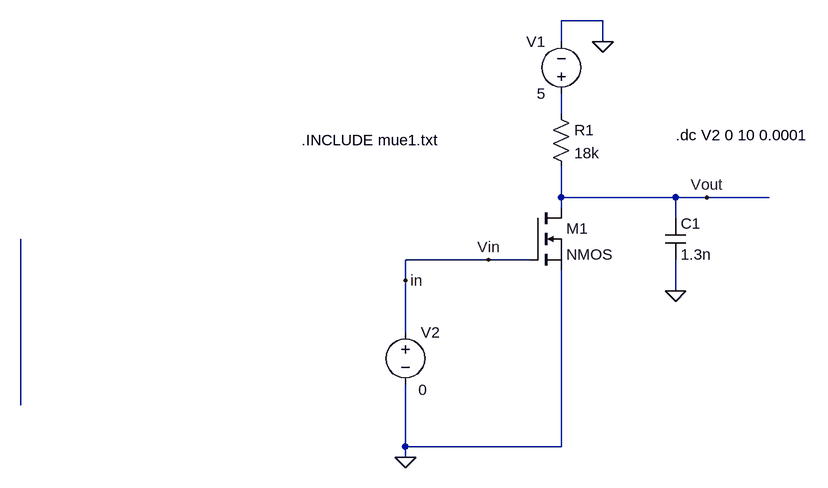
[diagram p0: schematic Q1.asc]
Q1.asc, the LTspice schematic file:
Version 4
SHEET 1 1716 680
WIRE 304 -64 240 -64
WIRE 240 -32 240 -64
WIRE 304 -32 304 -64
WIRE 240 80 240 48
WIRE 240 208 240 160
WIRE 416 208 240 208
WIRE 464 208 416 208
WIRE 560 208 464 208
WIRE 240 224 240 208
WIRE 416 240 416 208
WIRE 128 304 0 304
WIRE 192 304 128 304
WIRE 0 336 0 304
WIRE 416 352 416 304
WIRE 0 416 0 336
WIRE -592 528 -592 272
WIRE 0 592 0 496
WIRE 240 592 240 320
WIRE 240 592 0 592
WIRE 0 608 0 592
FLAG 0 608 0
FLAG 128 304 Vin
FLAG 464 208 Vout
FLAG 304 -32 0
FLAG 416 352 0
FLAG 0 336 in
SYMBOL nmos 192 224 R0
SYMATTR InstName M1
SYMBOL res 224 64 R0
SYMATTR InstName R1
SYMATTR Value 18k
SYMBOL voltage 240 64 R180
WINDOW 0 24 96 Left 2
WINDOW 3 24 16 Left 2
WINDOW 123 0 0 Left 0
WINDOW 39 0 0 Left 0
SYMATTR InstName V1
SYMATTR Value 5
SYMBOL cap 400 240 R0
SYMATTR InstName C1
SYMATTR Value 1.3n
SYMBOL voltage 0 400 R0
WINDOW 3 20 104 Left 2
WINDOW 123 24 124 Left 2
WINDOW 39 0 0 Left 0
SYMATTR InstName V2
SYMATTR Value 0
TEXT -160 120 Left 2 !.INCLUDE mue1.txt
TEXT 416 112 Left 2 !.dc V2 0 10 0.0001

The netlist it stands for:
* Q1.asc
M1 Vout in 0 0 NMOS
R1 N001 Vout 18k
V1 N001 0 5
C1 Vout 0 1.3n
V2 in 0 0
.model NMOS NMOS
.model PMOS PMOS
.lib standard.mos
.INCLUDE mue1.txt
.dc V2 0 10 0.0001
.backanno
.end